# EAGLE design sinket (EAGLE 6.5.0)
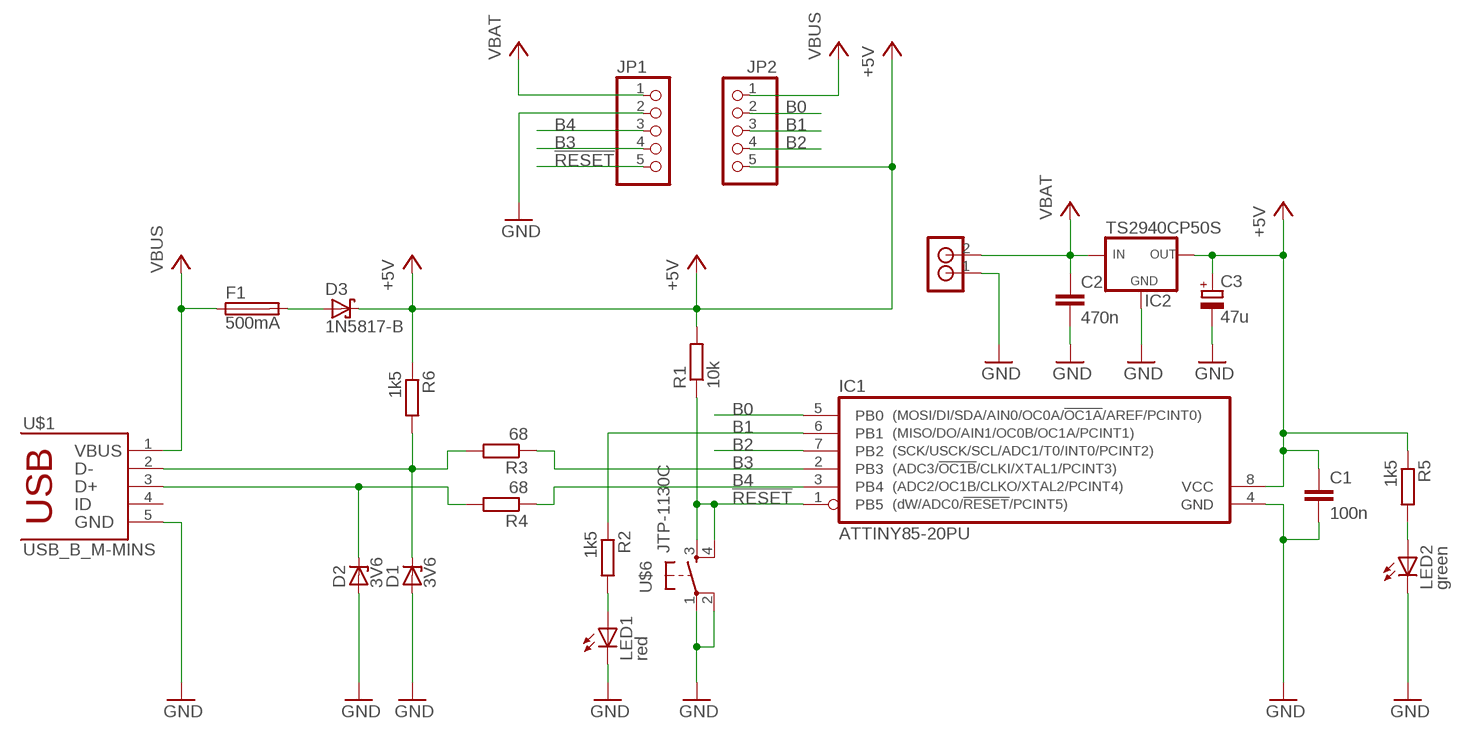
[diagram p0: schematic, sheet 1]

## Parts
C1  100n  C-EUC1206  [C1206]
C2  470n  C-EU050-025X075  [C050-025X075]
C3  47u  CPOL-EUE2.5-6  [E2,5-6]
D1  3V6  ZENER-DIODESOD80C  [SOD80C]
D2  3V6  ZENER-DIODESOD80C  [SOD80C]
D3  1N5817-B  [DO41-7.6]
F1  500mA  PTC-FUSE-LP60-050  [LP60-050]
IC1  ATTINY85-20PU  ATTINY25-20PU  [8P3]
IC2  TS2940CP50S  [TO-252]
JP1  PINHD-1X5  [1X05]
JP2  PINHD-1X5  [1X05]
LED1  red  LED5MM  [LED5MM]
LED2  green  LED5MM  [LED5MM]
R1  10k  R-EU_R1206  [R1206]
R2  1k5  R-EU_R1206  [R1206]
R3  68  R-EU_R1206  [R1206]
R4  68  R-EU_R1206  [R1206]
R5  1k5  R-EU_R1206  [R1206]
R6  1k5  R-EU_R1206  [R1206]
U$1  USB_B_M-MINS  [LUMBERG_2486-01]
U$6  JTP-1130C  [JTP-1130]
U$7  RIACON_101_2  [RIACON_101_2]

## Nets
!RESET: IC1.1(PB5) JP1.5 R1.1 U$6.3(S) U$6.4(S1)
+5V [supply]: C1.1 C3.+ D3.C IC1.8(VCC) IC2.3(OUT) JP2.5 R1.2 R5.1 R6.1
B0: IC1.5(PB0) JP2.2
B1: IC1.6(PB1) JP2.3 R2.1
B2: IC1.7(PB2) JP2.4
B3: IC1.2(PB3) JP1.4 R3.1
B4: IC1.3(PB4) JP1.3 R4.1
GND [supply]: C1.2 C2.2 C3.- D1.A D2.A IC1.4(GND) IC2.2(GND) JP1.2 LED1.K(C) LED2.K(C) U$1.5 U$6.1(P) U$6.2(P1) U$7.1
N$1: D1.C R3.2 R6.2 U$1.2
N$2 [supply]: D3.A F1.P$2
N$3: D2.C R4.2 U$1.3
N$4: LED1.A R2.2
N$5: LED2.A R5.2
VBAT [supply]: C2.1 IC2.1(IN) JP1.1 U$7.2
VBUS [supply]: F1.P$1 JP2.1 U$1.1
Unconnected: U$1.4

## Library data of the parts
C1 C2 = rcl:C-EU: CAPACITOR, European symbol
C3 = rcl:CPOL-EU: POLARIZED CAPACITOR, European symbol
D1 D2 = diode:ZENER-DIODE: Z-Diode
D3 = diode:1N581*: 1.0A SCHOTTKY BARRIER RECTIFIER Source: http://www.diodes.com/datasheets/ds23001.pdf
F1 = n39:PTC-FUSE: PTC Fuses This device contains different PTC fuses in different packages. All are polymeric positive temperature coefficient devices (PPTC, commonly known as a resettable fuse, polyfuse or polyswitch). See Wikipedia <https://en.wikipedia.org/wiki/Resettable_fuse> for a full explanation. Reichelt Bestellnr. Package Datasheet PTC194600-??? SMD-1812 SIBA-194600.pdf PTC194700-??? SMD-2920 – PFRA ??? radial LP60_?.pdf
IC1 = n39_avr:ATTINY25: Atmel AVR-RISC-Controller; REICHELT: ATTINY 25-20 PU
IC2 = n39:TS2940: 1A Ultra Low Dropout Fixed Positive Voltage Regulator; REICHELT: TS 2940 CP50
JP1 JP2 = pinhead:PINHD-1X5: PIN HEADER
LED1 LED2 = led:LED: LED OSRAM: - CHIPLED LG R971, LG N971, LY N971, LG Q971, LY Q971, LO R971, LY R971 LH N974, LH R974 LS Q976, LO Q976, LY Q976 LO Q996 - Hyper CHIPLED LW Q18S LB Q993, LB Q99A, LB R99A - SideLED LS A670, LO A670, LY A670, LG A670, LP A670 LB A673, LV A673, LT A673, LW A673 LH A674 LY A675 LS A676, LA A676, LO A676, LY A676, LW A676 LS A679, LY A679, LG A679 - Hyper Micro SIDELED® LS Y876, LA Y876, LO Y876, LY Y876 LT Y87S - SmartLED LW L88C, LW L88S LB L89C, LB L89S, LG L890 LS L89K, LO L89K, LY L89K LS L896, LA L896, LO L896, LY L896 - TOPLED LS T670, LO T670, LY T670, LG T670, LP T670 LSG T670, LSP T670, LSY T670, LOP T670, LYG T670 LG T671, LOG T671, LSG T671 LB T673, LV T673, LT T673, LW T673 LH T674 LS T676, LA T676, LO T676, LY T676, LB T676, LH T676, LSB T676, LW T676 LB T67C, LV T67C, LT T67C, LS T67K, LO T67K, LY T67K, LW E67C LS E67B, LA E67B, LO E67B, LY E67B, LB E67C, LV E67C, LT E67C LW T67C LS T679, LY T679, LG T679 LS T770, LO T770, LY T770, LG T770, LP T770 LB T773, LV T773, LT T773, LW T773 LH T774 LS E675, LA E675, LY E675, LS T675 LS T776, LA T776, LO T776, LY T776, LB T776 LHGB T686 LT T68C, LB T68C - Hyper Mini TOPLED® LB M676 - Mini TOPLED Santana® LG M470 LS M47K, LO M47K, LY M47K Source: http://www.osram.convergy.de LUXEON: - LUMILED® LXK2-PW12-R00, LXK2-PW12-S00, LXK2-PW14-U00, LXK2-PW14-V00 LXK2-PM12-R00, LXK2-PM12-S00, LXK2-PM14-U00 LXK2-PE12-Q00, LXK2-PE12-R00, LXK2-PE12-S00, LXK2-PE14-T00, LXK2-PE14-U00 LXK2-PB12-K00, LXK2-PB12-L00, LXK2-PB12-M00, LXK2-PB14-N00, LXK2-PB14-P00, LXK2-PB14-Q00 LXK2-PR12-L00, LXK2-PR12-M00, LXK2-PR14-Q00, LXK2-PR14-R00 LXK2-PD12-Q00, LXK2-PD12-R00, LXK2-PD12-S00 LXK2-PH12-R00, LXK2-PH12-S00 LXK2-PL12-P00, LXK2-PL12-Q00, LXK2-PL12-R00 Source: www.luxeon.com KINGBRIGHT: KA-3528ASYC Source: www.kingbright.com
R1-R6 = rcl:R-EU_: RESISTOR, European symbol
U$1 = n39:USB_B_M: USB 1.x and 2.x series "B" mini or micro plug; REICHELT: LUM 2486-01
U$6 = n39:JTP-1130: Kurzhubtaster 6x6mm, Höhe: 8,0mm, 12V, vertikal TASTER 9305 <http://www.reichelt.de/?ARTICLE=44586>; REICHELT: TASTER 9305
U$7 = n39:RIACON_101_2: RIACON Anschlussklemme (AKL) Typ 101 Rastermaß 5,08 mm; REICHELT: AKL 101-02

## Net classes
1 supply: width 0.406 mm

## Board
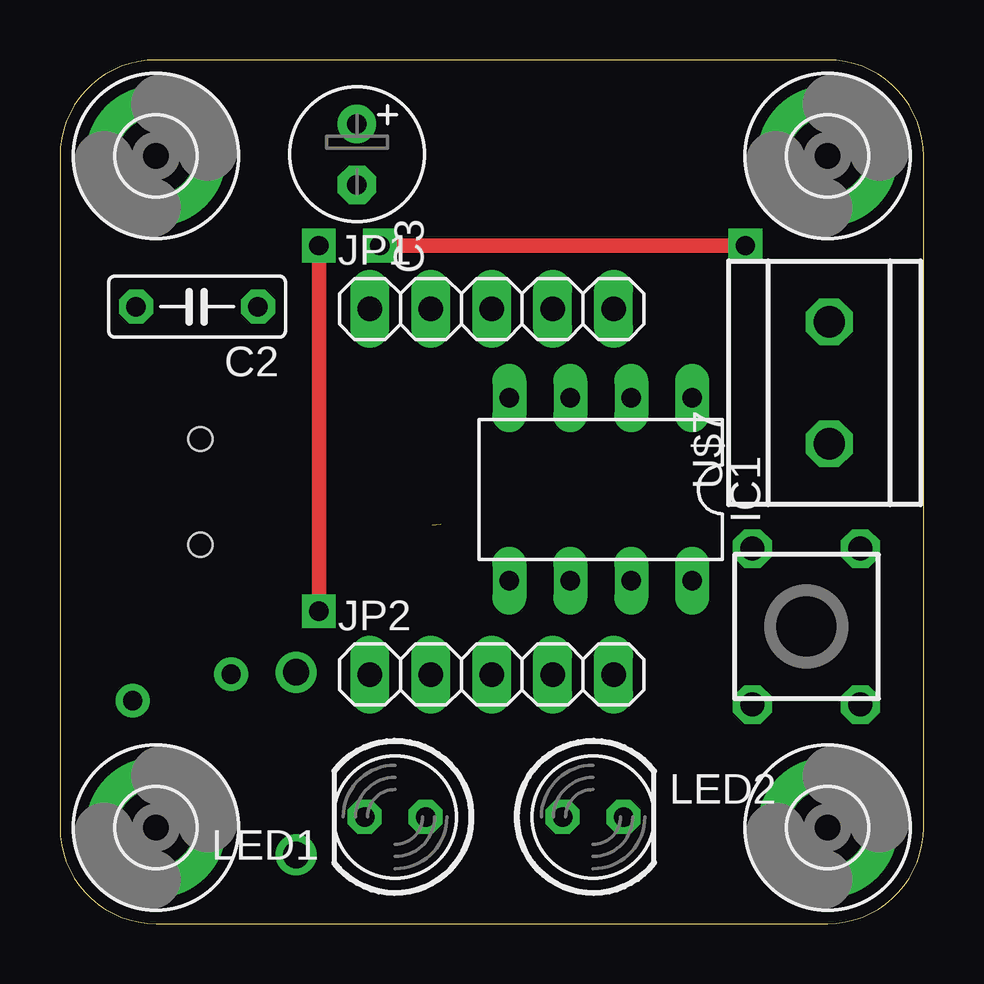
[diagram p1: board, top side]
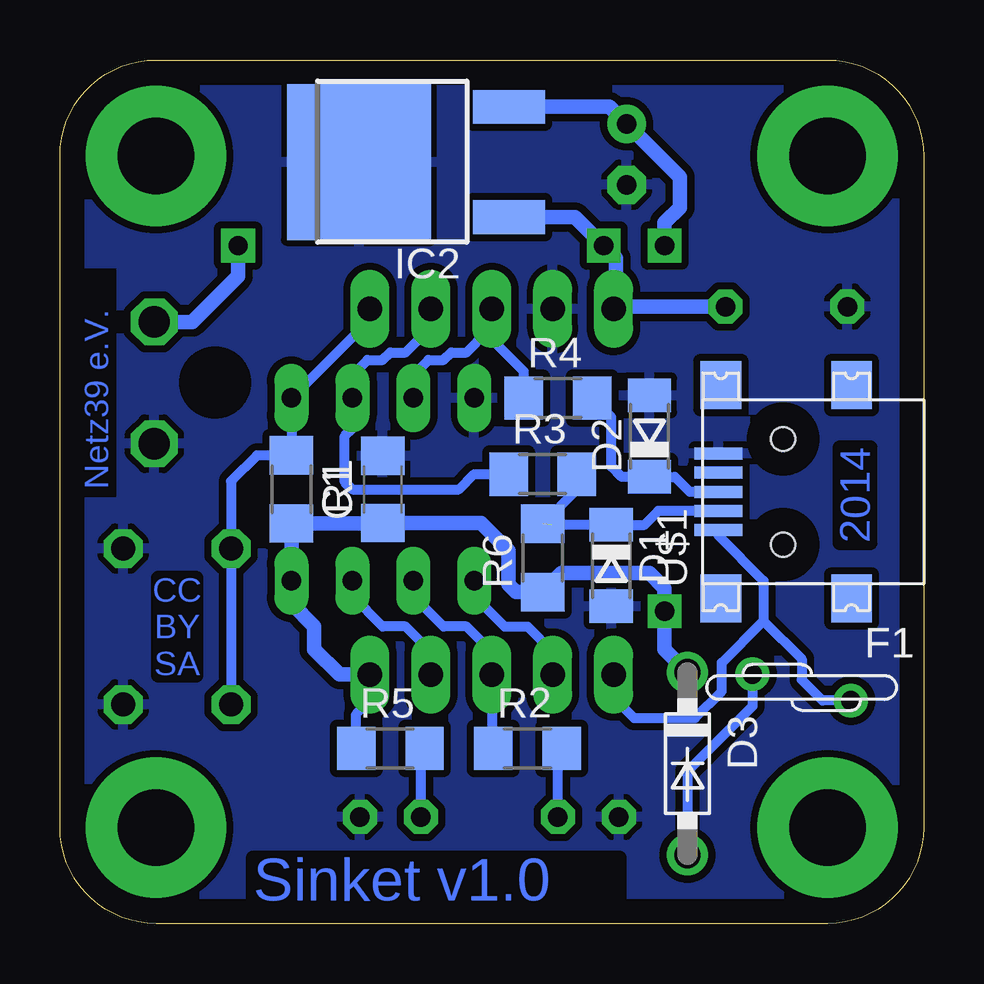
[diagram p2: board, bottom side, seen from below]

Size 36 x 36 mm. Coordinates in mm from the lower left corner, seen from the top.
Outline: 4,0 32,0 arc90 36,4 36,32 arc90 32,36 4,36 arc90 0,32 0,4 arc90 4,0
Copper layers (1*16): Top 0.035mm / dielectric 1.5mm / Bottom 0.035mm
Design rules "default *": minimum track width 10mil, minimum drill 0.8mm, track to track 12mil, track to pad 10mil, pad to pad 12mil, via to via 12mil, smd to smd 8mil, copper to edge 40mil, drill to drill 8mil, minimum pad ring 12mil, minimum via ring 12mil, stop-mask expansion 4mil, vias tented up to drill 0mil, thermal gap 10mil
bRestrict: area 28,21 to 31,24; area 33.7,17.8 to 34.9,27.3

### Footprints (pad centres in the part's own frame; a part is rotated, then mirrored left to right if it is on the bottom)
C1206 = smd 1.6 x 1.8: 1 -1.4,0; 2 1.4,0
C050-025X075 = drill 0.813 octagon: 1 -2.54,0; 2 2.54,0
E2,5-6 = drill 0.813 pad 1.6: + -1.27,0 | drill 0.813 pad 1.6 octagon: - 1.27,0
SOD80C = smd 1.4 x 1.8: A 1.7,0; C -1.7,0
DO41-7.6 = drill 1.1 pad 1.7: A 3.81,0; C -3.81,0
LP60-050 = drill 0.8: P$1 -2.05,0.55; P$2 2.05,-0.55
8P3 = drill 0.813 long: 1 -3.81,-3.81; 2 -1.27,-3.81; 3 1.27,-3.81; 4 3.81,-3.81; 5 3.81,3.81; 6 1.27,3.81; 7 -1.27,3.81; 8 -3.81,3.81
TO-252 = smd 1.4 x 3: 1 -2.3,-2.4; 3 2.3,-2.4 | smd 6.5 x 6: 2 0,3.85
1X05 = drill 1.016 long: 1 -5.08,0; 2 -2.54,0; 3 0,0; 4 2.54,0; 5 5.08,0
LED5MM = drill 0.813 octagon: A -1.27,0; K 1.27,0
R1206 = smd 1.6 x 1.803: 1 -1.422,0; 2 1.422,0
LUMBERG_2486-01 = smd 0.5 x 2: 1 -1.6,2.7; 2 -0.8,2.7; 3 0,2.7; 4 0.8,2.7; 5 1.6,2.7 | smd 2 x 1.7: P$1 4.45,2.6; P$2 4.45,-2.85; P$3 -4.45,-2.85; P$4 -4.45,2.6 | hole 1: 2.2,0; -2.2,0
3,2-PAD = drill 3.2 pad 5.842: B3,2 0,0
JTP-1130 = drill 1 octagon: 1 3.25,-2.25; 2 -3.25,-2.25; 3 3.25,2.25; 4 -3.25,2.25
RIACON_101_2 = drill 1.3 octagon: 1 -2.54,0; 2 2.54,0

### Placement (x,y rotation side)
C1  22.54,18.1 90 bottom
C2  5.71,25.72 180 top
C3  12.38,32.07 270 top
D1  13.02,14.92 270 bottom
D2  11.43,20.32 90 bottom
D3  9.84,6.67 270 bottom
F1  5.08,9.84 180 bottom
IC1  22.54,18.1 180 top
IC2  19.68,31.75 90 bottom
JP1  18,25.62 0 top
JP2  18,10.38 0 top
LED1  13.97,4.45 180 top
LED2  22.23,4.45 0 top
R1  26.35,18.1 270 bottom
R2  16.51,7.3 0 bottom
R3  15.88,18.73 0 bottom
R4  15.24,21.91 0 bottom
R5  22.23,7.3 0 bottom
R6  15.88,15.24 90 bottom
U$1  5.85,18 90 bottom
U$2  [3,2-PAD]  4,4 0 top
U$3  [3,2-PAD]  32,4 0 top
U$4  [3,2-PAD]  32,32 0 top
U$5  [3,2-PAD]  4,32 0 top
U$6  31.11,12.38 90 top
U$7  32.07,22.54 90 top

### Tracks (layer width: path | path; a pad name or v marks a point on that pad's centre or on a via)
!RESET
  Bottom 0.406: JP1.5 23.08,25.18 IC1.1 R1.1 27.79,19.52 28.86,18.44 U$6.3 U$6.4
+5V  (via drill 0.8)
  Top 0.61: v10.79,13.02 v10.79,28.26
  Bottom 0.406: R5.1 23.65,8.74 23.08,9.3 JP2.5
  Bottom 0.61: IC2.3 13.1,34.05 C3.+ 10.16,31.11 10.16,29.84 10.79,29.21 v10.79,28.26 | D3.C 10.79,11.43 v10.79,13.02 10.79,13.97 11.43,14.61 15.09,14.61 R6.1 16.99,13.82 17.3,14.13 17.3,15.56 18.44,16.7 C1.1 22.56,16.68 R1.2 IC1.8 26.35,13.34 25.4,12.38 25.4,11.43 24.35,10.38 JP2.5
B0
  Bottom 0.406: IC1.5 18.73,13.65 17.46,12.38 16.51,12.38 15.46,11.33 JP2.2
B1
  Bottom 0.406: IC1.6 21.27,13.65 20,12.38 19.05,12.38 18,11.33 JP2.3 18,7.37 R2.1
B2
  Bottom 0.406: JP2.4 20.54,11.33 21.59,12.38 22.54,12.38 23.81,13.65 IC1.7
B3
  Bottom 0.406: R3.1 18.73,18.73 19.37,18.1 23.81,18.1 24.13,18.41 24.13,20.32 23.81,20.64 IC1.2 23.81,22.86 23.18,23.5 22.54,23.5 22.23,23.81 21.59,23.81 20.54,24.86 JP1.4
B4
  Bottom 0.406: JP1.3 18,24.86 18.26,24.61 | 18.26,24.61 19.05,23.81 19.68,23.81 20,23.5 20.64,23.5 21.27,22.86 IC1.3 | R4.1 16.66,23.01 18.26,24.61
GND
  pour Bottom: 4,0 32,0 arc90 36,4 36,32 arc90 32,36 4,36 arc90 0,32 0,4 arc90
N$1  (1 unrouted)
  Bottom 0.406: U$1.2 11.06,17.2 11.63,16.62 D1.C 15.52,16.62 | R3.2 14.45,18.08 R6.2
N$2
  Bottom 0.406: F1.P$2 7.13,9.06 9.84,6.35 D3.A
N$3
  Bottom 0.406: U$1.3 9.74,18 10.37,18.62 D2.C 12.59,18.62 13.02,19.05 13.02,21.11 R4.2
N$4
  Bottom 0.406: LED1.A 15.24,7.15 R2.2
N$5
  Bottom 0.406: LED2.A 20.95,7.15 R5.2
VBAT  (via drill 0.8)
  Top 0.61: v28.57,28.26 v13.34,28.26
  Bottom 0.61: C2.1 12.82,25.72 | 12.82,25.72 JP1.1 | U$7.2 30.48,25.08 28.57,26.99 v28.57,28.26 | IC2.1 14.53,29.45 v13.34,28.26 12.82,27.75 12.82,25.72
VBUS
  Bottom 0.406: U$1.1 8.55,16.17 6.67,14.29 6.67,12.61 | JP2.1 12.92,9.43 12.06,8.57 9.53,8.57 8.41,9.68 8.41,10.87 6.67,12.61 | 6.67,12.61 5.08,11.03 5.08,10.16 4.21,9.29 F1.P$1

### Text on the board
Bottom: Netz39 e.V. | 2014 | CC / BY / SA | Sinket v1.0